# Altium schematic sheet New Gyro 4.0  - Interrogation Board.SchDoc
size 449 x 320 mm
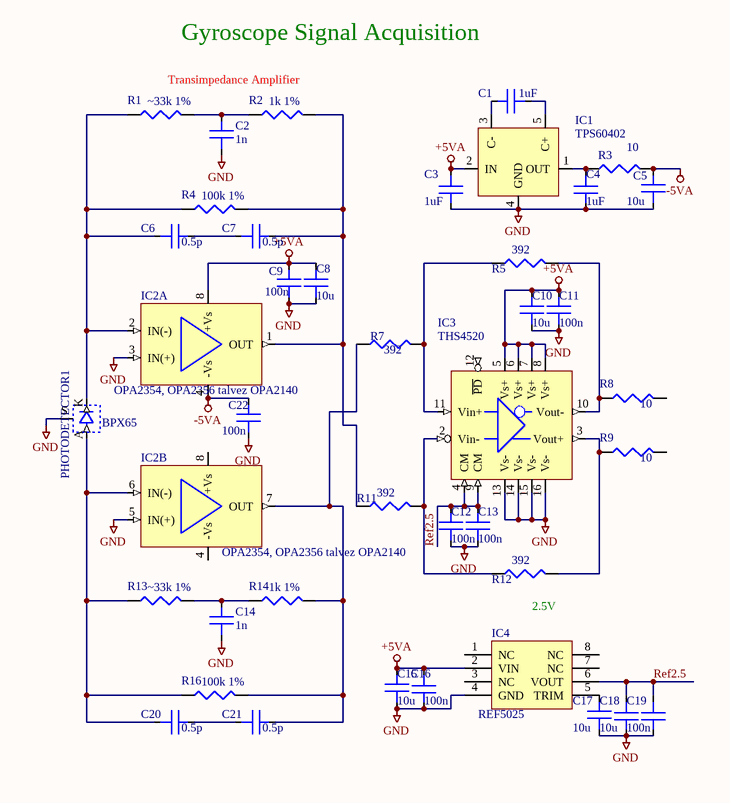
[diagram p0: New Gyro 4.0  - Interrogation Board.SchDoc]

## Parts
C1  1uF  [0805-cap]
C2  1n  [0805-cap]
C3  1uF  [0805-cap]
C4  1uF  [0805-cap]
C5  10u  [0805-cap]
C6  0.5p  [0805-cap]
C7  0.5p  [0805-cap]
C8  10u  [0805-cap]
C9  100n  [0805-cap]
C10  10u  [0805-cap]
C11  100n  [0805-cap]
C12  100n  [0805-cap]
C13  100n  [0805-cap]
C14  1n  [0805-cap]
C15  10u  [0805-cap]
C16  100n  [0805-cap]
C17  10u  [0805-cap]
C18  10u  [0805-cap]
C19  100n  [0805-cap]
C20  0.5p  [0805-cap]
C21  0.5p  [0805-cap]
C22  100n  [0805-cap]
IC1  TPS60402  [SOT-23-5]
IC2  OPA2354, OPA2356 talvez OPA2140  [MSOP8]  (parts A,B of 2)
IC3  THS4520  [QFN16]
IC4  REF5025  [MSOP8]
PHOTODETECTOR1  BPX65  [otico]
R1  ~33k 1%  [0805]
R2  1k 1%  [0805]
R3  10  [0805]
R4  100k 1%  [0805]
R5  392  [0805]
R7  392  [0805]
R8  10  [0805]
R9  10  [0805]
R11  392  [0805]
R12  392  [0805]
R13  ~33k 1%  [0805]
R14  1k 1%  [0805]
R16  100k 1%  [0805]

## Nets
+5VA: C3.2 C8.1 C9.1 C10.1 C11.1 C15.1 C16.2 IC1.2(IN) IC2.8(+Vs) IC3.5(Vs+) IC3.6(Vs+) IC3.7(Vs+) IC3.8(Vs+) IC4.2(VIN)
-5VA: C5.1 C22.1 IC2.4(-Vs) R3.2
GND: C2.2 C3.1 C4.1 C5.2 C8.2 C9.2 C10.2 C11.2 C12.2 C13.2 C14.2 C15.2 C16.1 C17.2 C18.1 C19.1 C22.2 IC1.4(GND) IC2.3(IN(+)) IC2.5(IN(+)) IC3.13(Vs-) IC3.14(Vs-) IC3.15(Vs-) IC3.16(Vs-) IC4.4(GND) PHOTODETECTOR1.S
Ref2.5: C12.1 C13.1 C18.2 C19.2 IC3.4(CM) IC3.9(CM) IC4.6(VOUT)
NetC1_1: C1.1 IC1.3(C-)
NetC1_2: C1.2 IC1.5(C+)
NetC2_1: C2.1 R1.2 R2.1
NetC4_2: C4.2 IC1.1(OUT) R3.1
NetC6_1: C6.1 C7.2
NetC6_2: C6.2 IC2.2(IN(-)) PHOTODETECTOR1.K R1.1 R4.1
NetC7_1: C7.1 IC2.1(OUT) R2.2 R4.2 R11.1
NetC14_1: C14.1 R13.2 R14.1
NetC17_1: C17.1 IC4.5(TRIM)
NetC20_1: C20.1 C21.2
NetC20_2: C20.2 IC2.6(IN(-)) PHOTODETECTOR1.A R13.1 R16.1
NetC21_1: C21.1 IC2.7(OUT) R7.1 R14.2 R16.2
NetIC3_2: IC3.2(Vin-) R11.2 R12.1
NetIC3_3: IC3.3(Vout+) R9.1 R12.2
NetIC3_10: IC3.10(Vout-) R5.2 R8.1
NetIC3_11: IC3.11(Vin+) R5.1 R7.2

Not connected (* = marked no-connect by the designer): IC3 12(~{PD}); IC4 1(NC) 3(NC) 7(NC) 8(NC); R8 2; R9 2

## Notes on the sheet
- Gyroscope Signal Acquisition
- Transimpedance Amplifier
- 2.5V

## Library data of the parts
C1-C22 = CAP: Capacitor Thick film
IC1 = TPS60401: Charge Pump Inverter
IC2 = AMPOPDUAL
IC3 = THS4520: WIDEBAND, LOW-DISTORTION, FULLY DIFFERENTIAL AMPLIFIER
IC4 = ADR440AMZ
PHOTODETECTOR1 = BYW29-150: Text Field1: 10; Text Field2: 20
R1-R5 R7-R9 R11-R14 R16 = R08: Resistor Thick film 1%